# EAGLE design w6_hello (EAGLE 8.0.1)
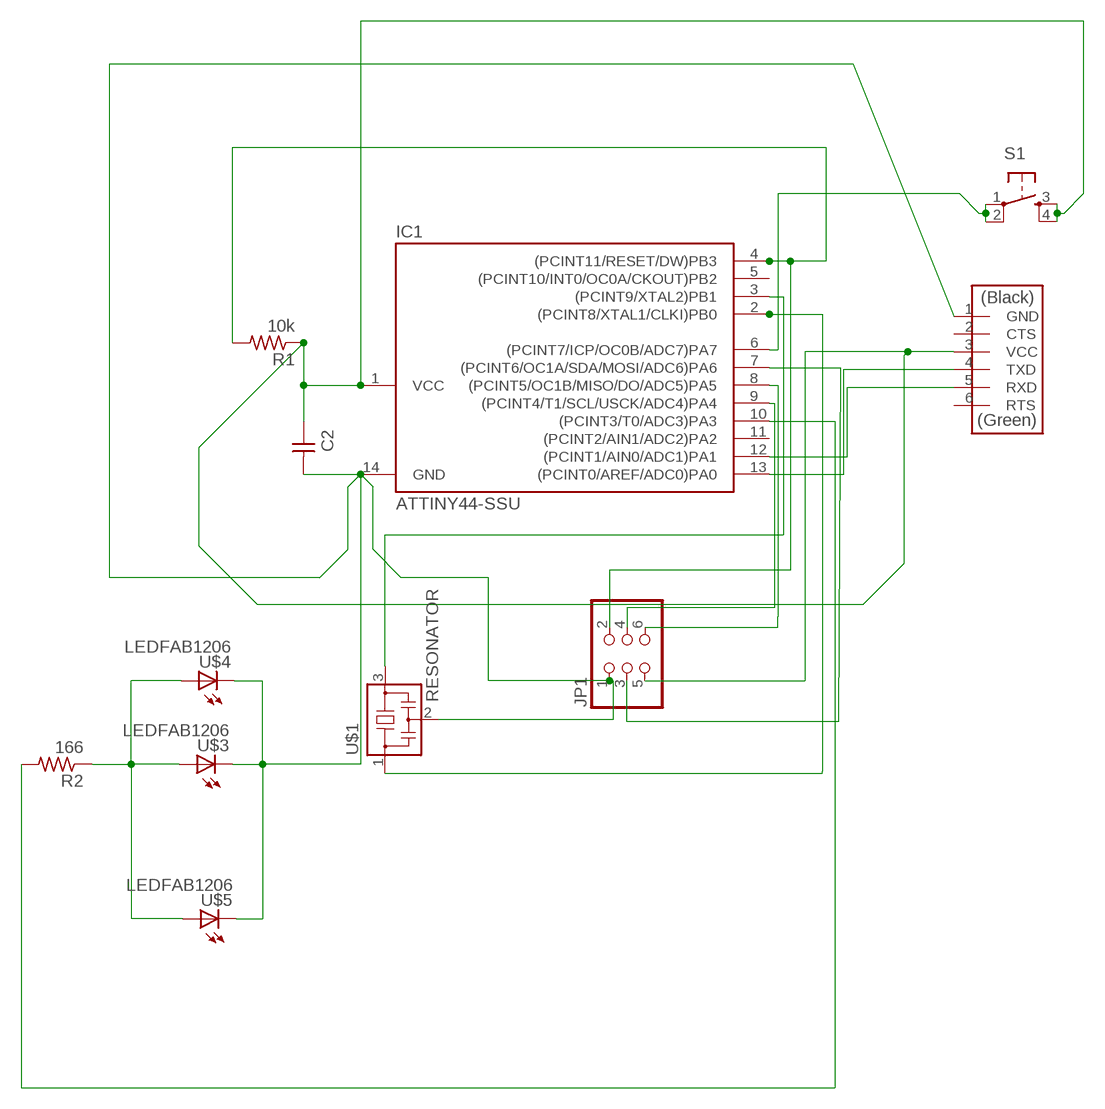
[diagram p0: schematic, sheet 1]

## Parts
C2  CAP-UNPOLARIZEDFAB  [C1206FAB]
IC1  ATTINY44-SSU  [SOIC14]
JP1  PINHD-2X3-SMD  [2X03SMD]
R1  10k  RES-US1206  [R1206]
R2  166  RES-US1206  [R1206]
S1  6MM_SWITCH6MM_SWITCH  [6MM_SWITCH]
U$1  RESONATOR  [EFOBM]
U$2  FTDI-SMD-HEADER  [1X06SMD]
U$3  LEDFAB1206  [LED1206FAB]
U$4  LEDFAB1206  [LED1206FAB]
U$5  LEDFAB1206  [LED1206FAB]

## Nets
N$1: R2.1 U$3.1(A) U$4.1(A) U$5.1(A)
N$2: IC1.10((PCINT3/T0/ADC3)PA3) R2.2
N$3: C2.1 IC1.1(VCC) JP1.5 R1.1 S1.3(S) S1.4(S1) U$2.3(VCC)
N$4: IC1.4((PCINT11/RESET/DW)PB3) JP1.2 R1.2
N$5: IC1.7((PCINT6/OC1A/SDA/MOSI/ADC6)PA6) JP1.3
N$6: IC1.2((PCINT8/XTAL1/CLKI)PB0) U$1.1
N$7: C2.2 IC1.14(GND) JP1.1 U$1.2 U$2.1(GND) U$3.2(C) U$4.2(C) U$5.2(C)
N$8: IC1.3((PCINT9/XTAL2)PB1) U$1.3
N$9: IC1.9((PCINT4/T1/SCL/USCK/ADC4)PA4) JP1.4
N$10: IC1.8((PCINT5/OC1B/MISO/DO/ADC5)PA5) JP1.6
N$11: IC1.13((PCINT0/AREF/ADC0)PA0) U$2.4(TXD)
N$12: IC1.12((PCINT1/AIN0/ADC1)PA1) U$2.5(RXD)
N$13: IC1.6((PCINT7/ICP/OC0B/ADC7)PA7) S1.1(P) S1.2(P1)
Unconnected: IC1.5((PCINT10/INT0/OC0A/CKOUT)PB2) IC1.11((PCINT2/AIN1/ADC2)PA2) U$2.2(CTS) U$2.6(RTS)

## Library data of the parts
C2 = fab:CAP-UNPOLARIZED
IC1 = fab:ATTINY44
JP1 = fab:PINHD-2X3-SMD: PIN HEADER
R1 R2 = fab:RES-US: Resistor (US Symbol) Variants with postfix FAB are widened to allow the routing of internal traces
S1 = fab:6MM_SWITCH: OMRON SWITCH
U$1 = fab:RESONATOR
U$2 = fab:FTDI-SMD-HEADER
U$3-U$5 = fab:LED: LED

## Net classes
1 ground: width 6.096 mm

## Board
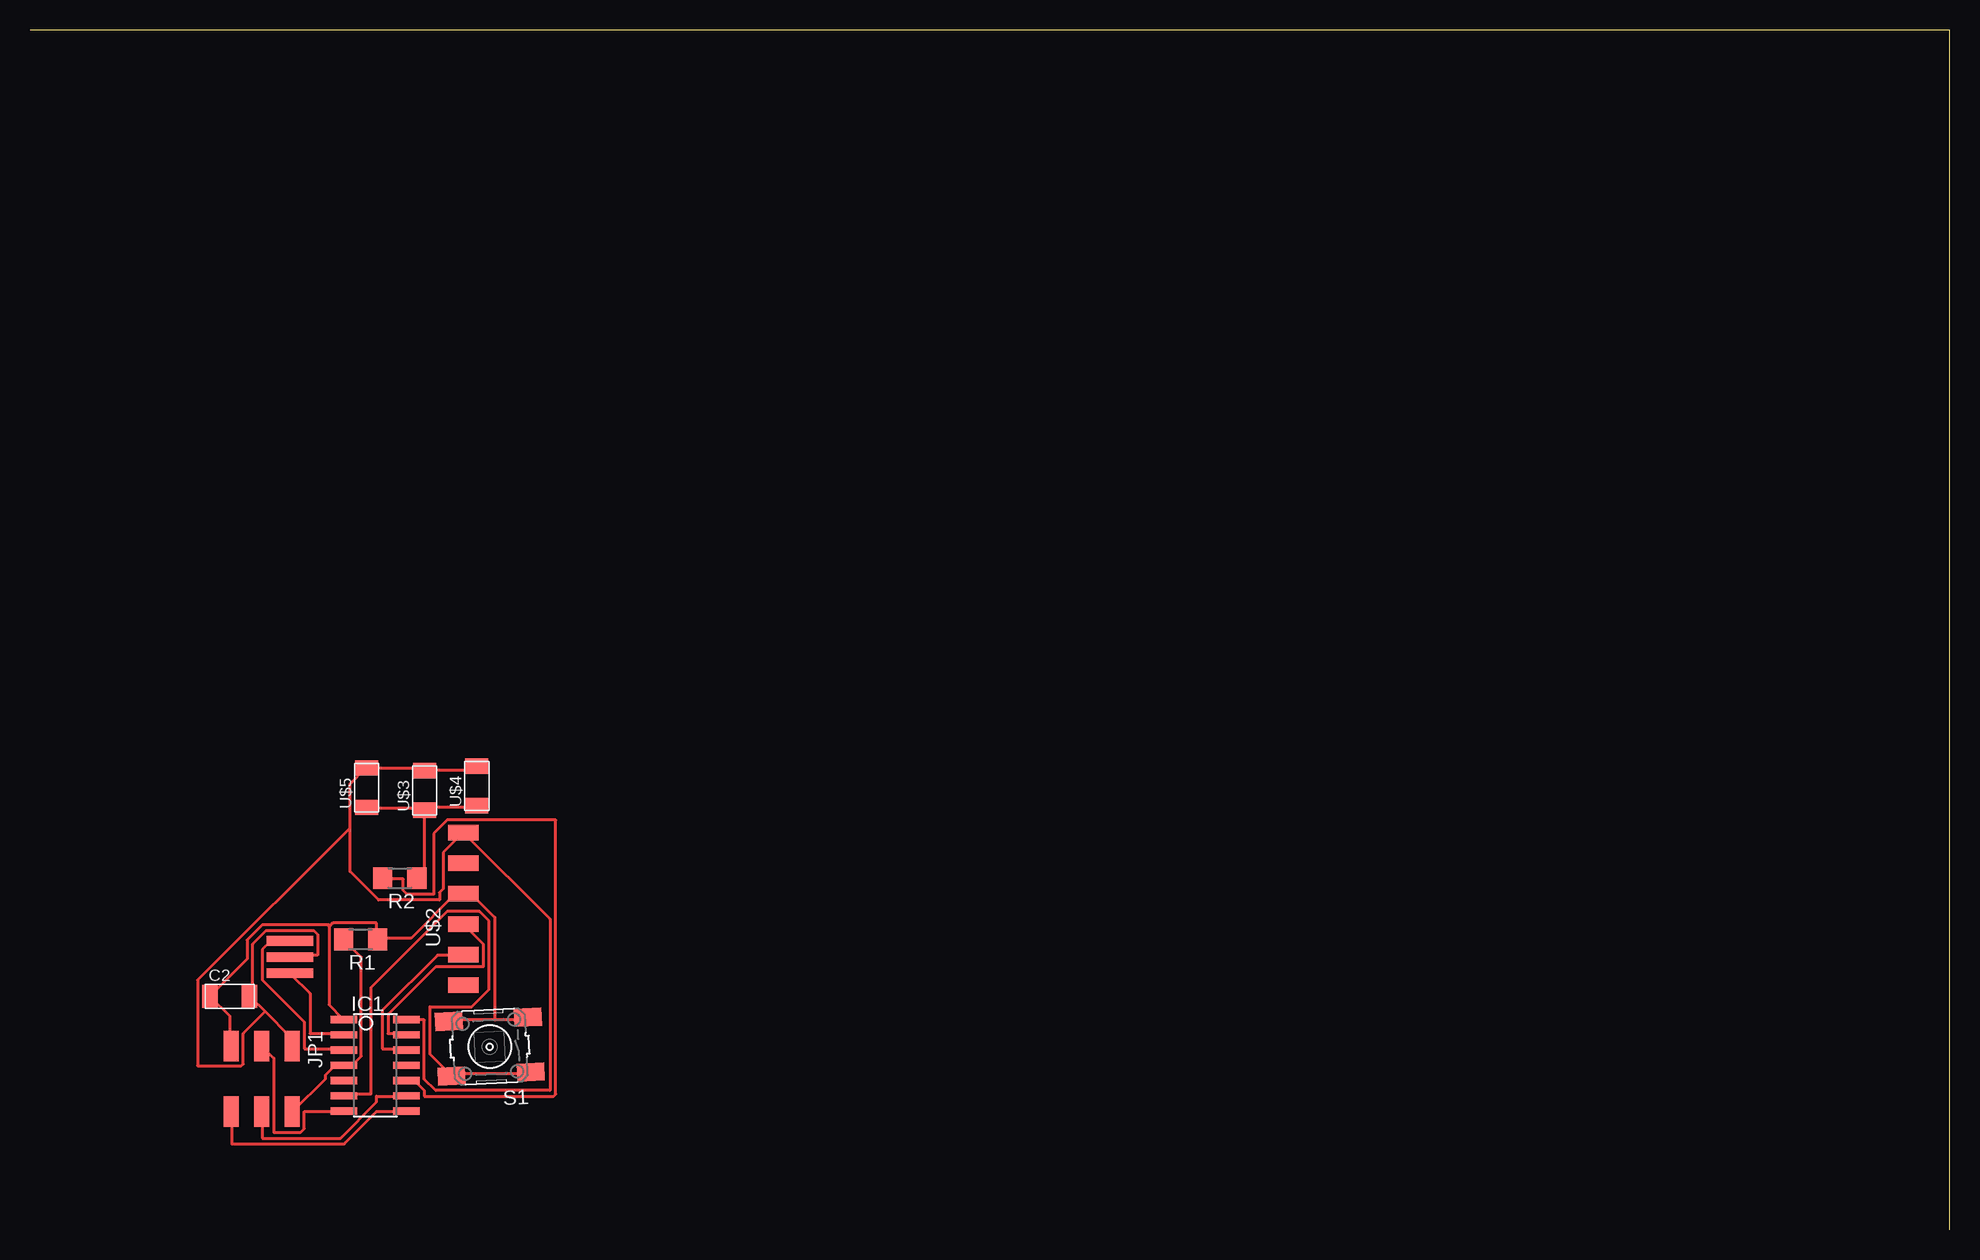
[diagram p1: board, top side]

Size 160 x 100 mm. Coordinates in mm from the lower left corner, seen from the top.
Outline: 160,0 160,100 0,100
Copper layers (1*16): Top 0.035mm / dielectric 1.5mm / Bottom 0.035mm
Design rules "default *": minimum track width 10mil, minimum drill 24mil, track to track 8mil, track to pad 8mil, pad to pad 8mil, via to via 8mil, smd to smd 8mil, copper to edge 40mil, drill to drill 8mil, minimum pad ring 10mil, minimum via ring 8mil, stop-mask expansion 4mil, vias tented up to drill 0mil, thermal gap 10mil

### Footprints (pad centres in the part's own frame; a part is rotated, then mirrored left to right if it is on the bottom)
C1206FAB = smd 1.27 x 1.905: 1 -1.651,0; 2 1.651,0
SOIC14 = smd 0.61 x 2.21: 1 -3.81,-2.603; 2 -2.54,-2.603; 3 -1.27,-2.603; 4 0,-2.603; 5 1.27,-2.603; 6 2.54,-2.603; 7 3.81,-2.603; 8 3.81,2.603; 9 2.54,2.603; 10 1.27,2.603; 11 0,2.603; 12 -1.27,2.603; 13 -2.54,2.603; 14 -3.81,2.603
2X03SMD = smd 2.54 x 1.27: 1 -2.54,2.54; 2 2.92,2.54; 3 -2.54,0; 4 2.92,0; 5 -2.54,-2.54; 6 2.92,-2.54
R1206 = smd 1.6 x 1.803: 1 -1.422,0; 2 1.422,0
6MM_SWITCH = smd 2.286 x 1.524: 1 -3.302,2.286; 2 3.302,2.286; 3 -3.302,-2.286; 4 3.302,-2.286
EFOBM = smd 0.8 x 3.9: 1 -1.35,0; 2 0,0; 3 1.35,0
1X06SMD = smd 2.54 x 1.27: 1 0,6.35; 2 0,3.81; 3 0,1.27; 4 0,-1.27; 5 0,-3.81; 6 0,-6.35
LED1206FAB = smd 1.27 x 1.905: 1 -1.651,0; 2 1.651,0

### Placement (x,y rotation side)
C2  16.65,19.43 0 top
IC1  28.78,13.69 270 top
JP1  19.32,12.74 270 top
R1  27.56,24.19 180 top
R2  30.82,29.3 180 top
S1  38.32,15.24 182.9 top
U$1  21.66,22.71 90 top
U$2  36.13,26.73 0 top
U$3  32.89,36.6 90 top
U$4  37.24,36.98 90 top
U$5  28.07,36.83 90 top

### Tracks (layer width: path | path; a pad name or v marks a point on that pad's centre or on a via)
N$1
  Top 0.254: R2.1 32.38,29.37 32.86,29.84 32.86,34.92 U$3.1 | U$5.1 28.1,35.08 32.86,35.08 U$3.1 | U$4.1 37.15,35.24 33.02,35.24 33.02,35.08 U$3.1
N$2
  Top 0.254: R2.2 29.53,29.21 31.11,29.21 31.11,28.26 31.43,27.94 33.66,27.94 33.66,33.02 34.77,34.13 43.81,34.13 43.81,11.27 43.66,11.11 32.86,11.11 32.86,11.59 32.07,12.38 31.43,12.38 IC1.10
N$3
  Top 0.254: 38.73,17.46 41.43,17.46 41.43,17.62 S1.3 | 38.73,17.46 34.92,17.46 S1.4 | JP1.5 16.67,15.4 16.67,17.78 15.08,19.37 C2.1 15.08,19.53 18.1,22.54 18.1,24.13 19.37,25.4 24.92,25.4 25,25.32 | 25,25.32 25.24,25.56 28.89,25.56 28.89,24.29 R1.1 29.05,24.29 31.75,24.29 35.4,27.94 36.04,27.94 U$2.3 36.2,27.94 36.83,27.94 38.73,26.04 38.73,17.46 | 25,25.32 24.92,25.24 24.92,18.73 26.04,17.62 IC1.1
N$4
  Top 0.254: R1.2 26.19,24.13 27.62,22.7 27.62,14.45 26.99,13.81 26.19,13.81 IC1.4 26.04,13.65 25.4,13.65 24.61,12.86 24.61,12.54 21.91,9.84 JP1.2
N$5
  Top 0.254: IC1.7 26.04,9.84 22.86,9.84 22.86,8.41 22.54,8.1 20.32,8.1 20.32,14.29 19.37,15.24 JP1.3
N$6
  Top 0.254: IC1.2 26.04,16.35 23.34,16.35 23.34,19.68 21.75,21.27 U$1.1
N$7
  Top 0.254: 19.61,18.18 21.75,16.03 21.75,15.4 JP1.1 | 19.61,18.18 18.41,19.37 C2.2 18.57,19.37 18.57,23.81 19.68,24.92 23.65,24.92 23.97,24.61 23.97,22.86 21.75,22.86 U$1.2 | U$4.2 37.15,38.58 37.15,38.26 33.02,38.26 U$3.2 32.86,38.26 32.86,38.42 28.1,38.42 U$5.2 27.94,38.42 26.67,37.15 26.67,33.5 | IC1.14 31.43,17.46 32.86,17.46 32.86,12.54 33.81,11.59 43.34,11.59 43.34,25.88 36.2,33.02 U$2.1 36.04,33.02 34.45,31.43 34.45,28.42 34.13,28.1 34.13,27.46 29.05,27.46 26.67,29.84 26.67,33.5 | 19.61,18.18 17.78,16.35 17.78,13.81 17.62,13.65 13.97,13.65 13.97,20.8 26.67,33.5
N$8
  Top 0.254: IC1.3 26.04,15.08 22.86,15.08 22.86,17.3 19.37,20.8 19.37,23.34 20,23.97 21.59,23.97 U$1.3
N$9
  Top 0.254: IC1.9 31.27,11.11 28.89,11.11 28.89,10.64 25.88,7.62 19.37,7.62 19.37,9.68 JP1.4
N$10
  Top 0.254: IC1.8 31.27,9.84 28.89,9.84 26.19,7.14 16.83,7.14 16.83,9.68 JP1.6
N$11
  Top 0.254: IC1.13 31.27,16.35 29.84,16.35 29.84,17.94 33.81,21.91 37.78,21.91 37.78,23.81 36.2,25.4 U$2.4
N$12
  Top 0.254: IC1.12 31.27,15.08 29.37,15.08 29.37,18.26 33.97,22.86 36.04,22.86 U$2.5
N$13
  Top 0.254: IC1.6 26.19,11.27 28.42,11.27 28.42,20.16 34.77,26.51 37.47,26.51 38.26,25.72 38.26,20 36.83,18.57 33.34,18.57 33.34,14.61 35.08,12.86 S1.2 35.08,13.02 41.59,13.02 S1.1

### Text on the board
201bmp: C:/Users/ziosm/Desktop/files/openhand.bmp